# Altium schematic sheet Sheet2.SchDoc
size A3
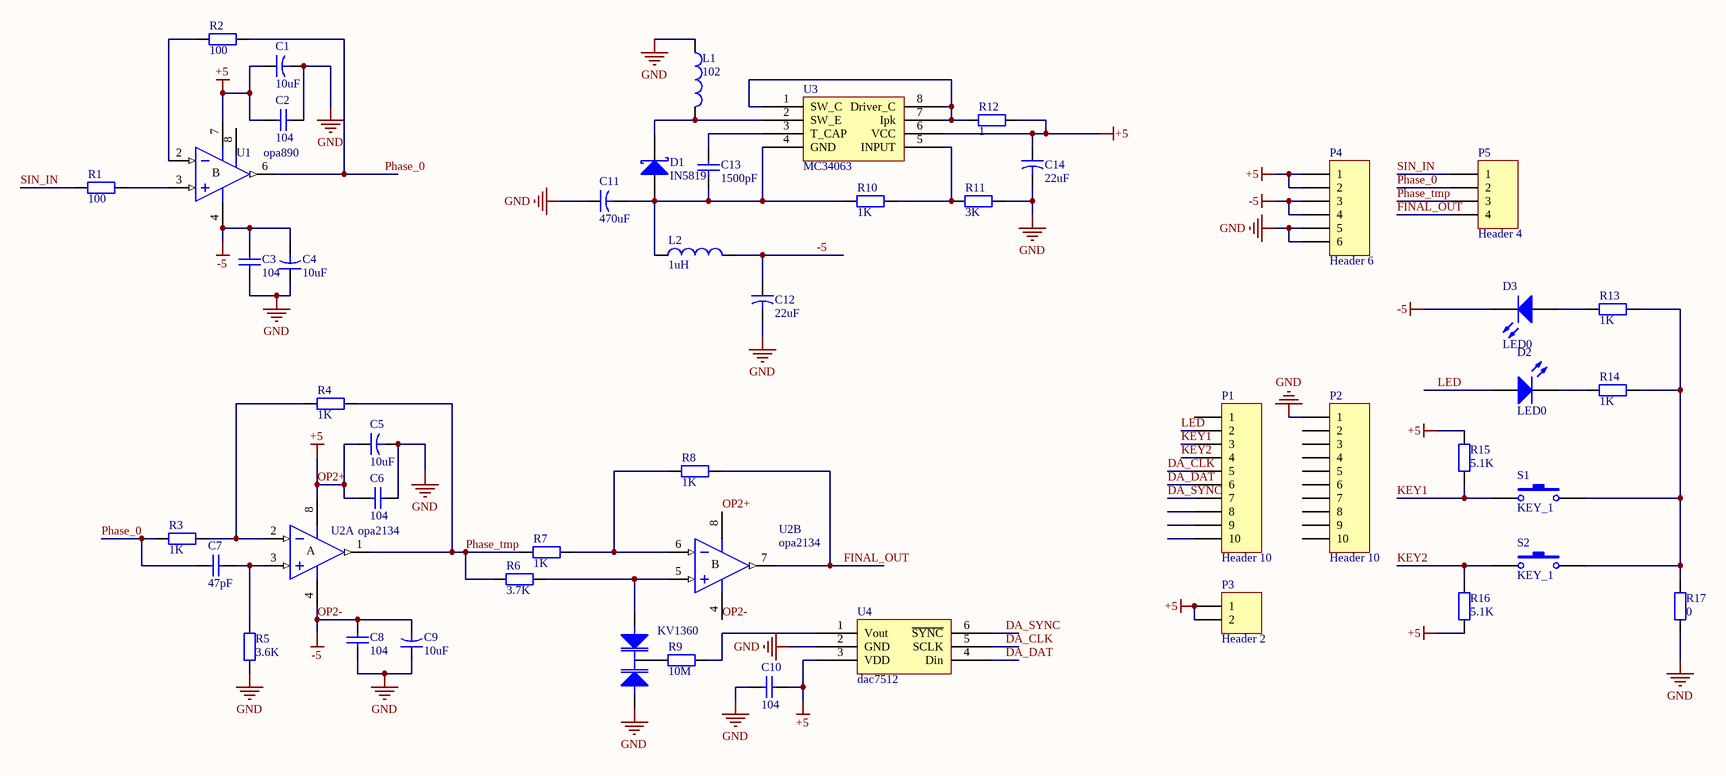
[diagram p0: Sheet2.SchDoc]

## Parts
*  KV1360  [T092-3]
C1  value 10uF  [1812]  (hidden comment: Cap2)
C2  value 104  [C0805]  (hidden comment: Cap)
C3  value 104  [C0805]  (hidden comment: Cap)
C4  value 10uF  [1812]  (hidden comment: Cap2)
C5  value 10uF  [1812]  (hidden comment: Cap2)
C6  value 104  [C0805]  (hidden comment: Cap)
C7  value 47pF  [C0805]  (hidden comment: Cap)
C8  value 104  [C0805]  (hidden comment: Cap)
C9  value 10uF  [1812]  (hidden comment: Cap2)
C10  value 104  [C0805]  (hidden comment: Cap)
C11  value 470uF  [CAPPR2-5x6.8]  (hidden comment: Cap2)
C12  value 22uF  [CAPPR2-5x6.8]  (hidden comment: Cap2)
C13  value 1500pF  [C0805]  (hidden comment: Cap)
C14  value 22uF  [CAPPR2-5x6.8]  (hidden comment: Cap2)
D1  IN5819  [1812]
D2  LED0  [C0805]
D3  LED0  [C0805]
L1  value 102  [RB5-10.5]  (hidden comment: Inductor)
L2  value 1uH  [2012[0805]]  (hidden comment: Inductor)
P1  Header 10  [HDR1X10]
P2  Header 10  [HDR1X10]
P3  Header 2  [HDR1X2]
P4  Header 6  [HDR1X6]
P5  Header 4  [HDR1X4]
R1  value 100  [2012[0805]]  (hidden comment: Res2)
R2  value 100  [2012[0805]]  (hidden comment: Res2)
R3  value 1K  [2012[0805]]  (hidden comment: Res2)
R4  value 1K  [2012[0805]]  (hidden comment: Res2)
R5  value 3.6K  [2012[0805]]  (hidden comment: Res2)
R6  value 3.7K  [2012[0805]]  (hidden comment: Res2)
R7  value 1K  [2012[0805]]  (hidden comment: Res2)
R8  value 1K  [2012[0805]]  (hidden comment: Res2)
R9  value 10M  [2012[0805]]  (hidden comment: Res2)
R10  value 1K  [2012[0805]]  (hidden comment: Res2)
R11  value 3K  [2012[0805]]  (hidden comment: Res2)
R12  value 1  [2012[0805]]  (hidden comment: Res2)
R13  value 1K  [2012[0805]]  (hidden comment: Res2)
R14  value 1K  [2012[0805]]  (hidden comment: Res2)
R15  value 5.1K  [2012[0805]]  (hidden comment: Res2)
R16  value 5.1K  [2012[0805]]  (hidden comment: Res2)
R17  value 0  [2012[0805]]  (hidden comment: Res2)
S1  KEY_1  [SW]
S2  KEY_1  [SW]
U1  opa890  [SO-8_N]
U2  opa2134  [SO-8_N]  (parts A,B of 2)
U3  MC34063  [SO-8_N]
U4  dac7512  [SOT23-6]

## Nets
-5: C3.2 C4.2 C8.2 C9.2 C12.1 D3.2(K) L2.2 P4.3 P4.4 U1.4(V-) U2.4(V-)  [also labelled OP2-]
GND: *.1 C1.2 C2.2 C3.1 C4.1 C5.2 C6.2 C8.1 C9.1 C10.1 C11.1 C12.2 C14.2 L1.1 P2.1 P4.5 P4.6 R5.1 R11.1 R17.1 U4.2(GND)
OP2+: C1.1 C2.1 C5.1 C6.1 C10.2 C14.1 P3.1 P3.2 P4.1 P4.2 R12.2 R15.1 R16.2 U1.7(V+) U2.8(V+) U3.6(VCC) U4.3(VDD)  [also labelled +5]
DA_CLK: P1.5 U4.5(SCLK)
DA_DAT: P1.6 U4.4(Din)
DA_SYNC: P1.7 U4.6(~{SYNC})
FINAL_OUT: P5.4 R8.2 U2.7(OUT)
KEY1: P1.3 R15.2 S1.1
KEY2: P1.4 R16.1 S2.1
LED: D2.1(A) P1.2
Phase_0: C7.2 P5.2 R2.2 R3.1 U1.6(OUT)
Phase_tmp: P5.3 R4.2 R6.1 R7.1 U2.1(OUT)
SIN_IN: P5.1 R1.1
Net*_2: *.2 R9.2
Net*_3: *.3 R6.2 U2.5(IN+)
NetC7_1: C7.1 R5.2 U2.3(IN+)
NetC11_2: C11.2 C13.1 D1.1(A) L2.1 R10.1 U3.4(GND)
NetC13_2: C13.2 U3.3(T_CAP)
NetD1_2: D1.2(K) L1.2 U3.2(SW_E)
NetD2_2: D2.2(K) R14.2
NetD3_1: D3.1(A) R13.2
NetR1_2: R1.2 U1.3(IN+)
NetR2_1: R2.1 U1.2(IN-)
NetR3_2: R3.2 R4.1 U2.2(IN-)
NetR7_2: R7.2 R8.1 U2.6(IN-)
NetR9_1: R9.1 U4.1(Vout)
NetR10_2: R10.2 R11.2 U3.5(INPUT)
NetR12_1: R12.1 U3.1(SW_C) U3.7(Ipk) U3.8(Driver_C)
NetR13_1: R13.1 R14.1 R17.2 S1.2 S2.2

Not connected (* = marked no-connect by the designer): P1 1 8 9 10; P2 2 3 4 5 6 7 8 9 10; U1 8(~{DIS})

## Notes on the sheet
- (in symbol opa890) B
- (in symbol opa2134, part A) A
- (in symbol opa2134, part B) B

## Library data of the parts
C1 C4 C5 C9 C11 C12 C14 = Cap2: Capacitor; Published: 23-Sep-2002; PackageReference: CAPR5-4X5; Publisher: Altium Limited
C2 C3 C6-C8 C10 C13 = Cap: Capacitor; Published: 8-Jun-2000; LatestRevisionDate: 17-Jul-2002; LatestRevisionNote: Re-released for DXP Platform.; PackageReference: RAD-0.3; Publisher: Altium Limited
D1 = Diode 11DQ03: Schottky Rectifier; Published: 8-Jun-2000; LatestRevisionDate: 17-Jul-2002; LatestRevisionNote: Re-released for DXP Platform.; DatasheetVersion: Dec-1997; PackageReference: DO-204AL; Publisher: Altium Limited; Code_JEDEC: DO-204-AL; ComponentLink1Description: Manufacturer Link; ComponentLink1URL: http://www.irf.com/; ComponentLink2Description: Datasheet; ComponentLink2URL: http://www.irf.com/product-info/datasheets/data/11dq03.pdf
D2 D3 = LED0: Typical INFRARED GaAs LED; Published: 8-Jun-2000; LatestRevisionDate: 08-Jul-2005; LatestRevisionNote: Mech Layer 1 removed.; PackageReference: LED-0; Publisher: Altium Limited
L1 L2 = Inductor: Code_IEC: 1005; Published: 8-Jun-2000; LatestRevisionDate: 29-May-2009; LatestRevisionNote: IPC-7351 Footprint Added.; PackageReference: 0402-A; Publisher: Altium Limited; PackageDescription: Chip Inductor; Code_JEITA: 0402
P1 P2 = Header 10: Header, 10-Pin; LatestRevisionDate: 17-Jul-2002; LatestRevisionNote: Re-released for DXP Platform.; Publisher: Altium Limited
P3 = Header 2: Header, 2-Pin; LatestRevisionDate: 17-Jul-2002; LatestRevisionNote: Re-released for DXP Platform.; Publisher: Altium Limited
P4 = Header 6: Header, 6-Pin; LatestRevisionDate: 17-Jul-2002; LatestRevisionNote: Re-released for DXP Platform.; Publisher: Altium Limited
P5 = Header 4: Header, 4-Pin; LatestRevisionDate: 17-Jul-2002; LatestRevisionNote: Re-released for DXP Platform.; Publisher: Altium Limited
R1-R17 = Res2: Resistor; Published: 8-Jun-2000; LatestRevisionDate: 17-Jul-2002; LatestRevisionNote: Re-released for DXP Platform.; PackageReference: AXIAL-0.4; Publisher: Altium Limited
S1 S2 = SW-PB: Switch; Published: 24-Mar-1999; LatestRevisionDate: 17-Jul-2002; LatestRevisionNote: Re-released for DXP Platform.; PackageReference: SPST-2; Publisher: Altium Limited